# Vivado block design bd_48ac, xcvu9p-flga2104-2L-e, Vivado 2018.2
# (continued, part 3 of 4)
current_bd_instance /s09_entry_pipeline

create_bd_cell -type ip -vlnv xilinx.com:ip:sc_mmu:1.0 s09_mmu
set_property -dict [list \
  CONFIG.IS_CASCADED 0 \
  CONFIG.NUM_SEG 3 \
  CONFIG.MSC_ROUTE_WIDTH 1 \
  CONFIG.NUM_MSC 1 \
  CONFIG.ADDR_WIDTH 32 \
  CONFIG.RDATA_WIDTH 32 \
  CONFIG.WDATA_WIDTH 32 \
  CONFIG.S_PROTOCOL AXI4LITE \
  CONFIG.READ_WRITE_MODE READ_WRITE \
  CONFIG.SEG000_BASE_ADDR 0x0000000000000000 \
  CONFIG.SEG000_SIZE 29 \
  CONFIG.SEG000_SEP_ROUTE 0b0000000000000000000000000000000000000000000000000000000000000100 \
  CONFIG.SEG000_SUPPORTS_READ 1 \
  CONFIG.SEG000_SUPPORTS_WRITE 1 \
  CONFIG.SEG000_SECURE_READ 0 \
  CONFIG.SEG000_SECURE_WRITE 0 \
  CONFIG.SEG001_BASE_ADDR 0x0000000044A00000 \
  CONFIG.SEG001_SIZE 16 \
  CONFIG.SEG001_SEP_ROUTE 0b0000000000000000000000000000000000000000000000000000000000000010 \
  CONFIG.SEG001_SUPPORTS_READ 1 \
  CONFIG.SEG001_SUPPORTS_WRITE 1 \
  CONFIG.SEG001_SECURE_READ 0 \
  CONFIG.SEG001_SECURE_WRITE 0 \
  CONFIG.SEG002_BASE_ADDR 0x0000000080000000 \
  CONFIG.SEG002_SIZE 31 \
  CONFIG.SEG002_SEP_ROUTE 0b0000000000000000000000000000000000000000000000000000000000000000 \
  CONFIG.SEG002_SUPPORTS_READ 1 \
  CONFIG.SEG002_SUPPORTS_WRITE 1 \
  CONFIG.SEG002_SECURE_READ 0 \
  CONFIG.SEG002_SECURE_WRITE 0 \
  CONFIG.MSC000_ROUTE 0b1 \
] [get_bd_cells s09_mmu]
create_bd_cell -type ip -vlnv xilinx.com:ip:sc_transaction_regulator:1.0 s09_transaction_regulator
set_property -dict [list \
  CONFIG.READ_WRITE_MODE READ_WRITE \
  CONFIG.IS_CASCADED 0 \
  CONFIG.MEP_IDENTIFIER 19 \
  CONFIG.MEP_IDENTIFIER_WIDTH 6 \
  CONFIG.ADDR_WIDTH 32 \
  CONFIG.S_ID_WIDTH 0 \
  CONFIG.WDATA_WIDTH 32 \
  CONFIG.RDATA_WIDTH 32 \
  CONFIG.SEP_ROUTE_WIDTH 3 \
  CONFIG.SUPPORTS_READ_DEADLOCK 1 \
  CONFIG.SUPPORTS_WRITE_DEADLOCK 1 \
] [get_bd_cells s09_transaction_regulator]
create_bd_cell -type ip -vlnv xilinx.com:ip:sc_si_converter:1.0 s09_si_converter
set_property -dict [list \
  CONFIG.READ_WRITE_MODE READ_WRITE \
  CONFIG.LIMIT_READ_LENGTH 0 \
  CONFIG.LIMIT_WRITE_LENGTH 0 \
  CONFIG.IS_CASCADED 0 \
  CONFIG.NUM_READ_THREADS 1 \
  CONFIG.NUM_WRITE_THREADS 1 \
  CONFIG.MEP_IDENTIFIER_WIDTH 6 \
  CONFIG.SUPPORTS_NARROW 0 \
  CONFIG.HAS_BURST 0 \
  CONFIG.NUM_SEG 3 \
  CONFIG.ADDR_WIDTH 32 \
  CONFIG.ID_WIDTH 6 \
  CONFIG.RDATA_WIDTH 32 \
  CONFIG.WDATA_WIDTH 32 \
  CONFIG.NUM_MSC 1 \
  CONFIG.S_RUSER_BITS_PER_BYTE 0 \
  CONFIG.S_WUSER_BITS_PER_BYTE 0 \
  CONFIG.MAX_RUSER_BITS_PER_BYTE 0 \
  CONFIG.MAX_WUSER_BITS_PER_BYTE 0 \
  CONFIG.SEP000_RDATA_WIDTH 32 \
  CONFIG.SEP000_WDATA_WIDTH 32 \
  CONFIG.SEP000_PROTOCOL AXI4LITE \
  CONFIG.SEP001_RDATA_WIDTH 32 \
  CONFIG.SEP001_WDATA_WIDTH 32 \
  CONFIG.SEP001_PROTOCOL AXI4LITE \
  CONFIG.SEP002_RDATA_WIDTH 512 \
  CONFIG.SEP002_WDATA_WIDTH 512 \
  CONFIG.SEP002_PROTOCOL AXI4 \
  CONFIG.MSC000_RDATA_WIDTH 512 \
  CONFIG.MSC000_WDATA_WIDTH 512 \
] [get_bd_cells s09_si_converter]

# ---- hierarchy /s09_nodes ----
current_bd_instance /s09_nodes
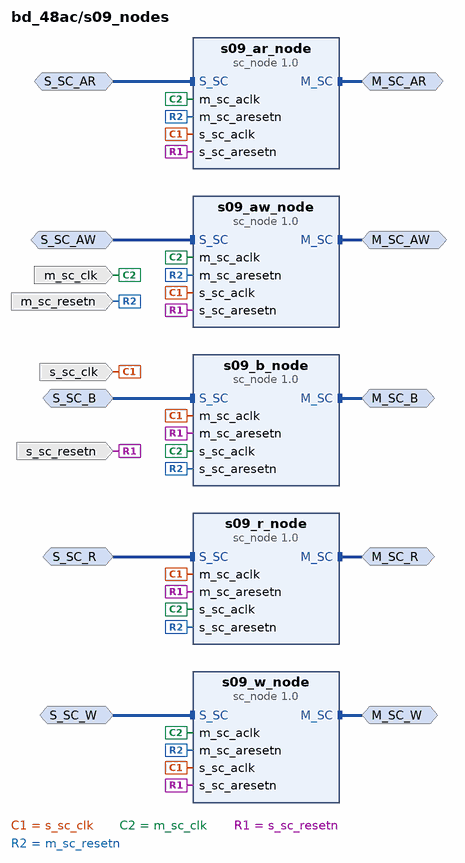
[diagram p22: block diagram inside /s09_nodes]
create_bd_intf_pin -mode Master -vlnv xilinx.com:interface:sc_rtl:1.0 M_SC_AR
create_bd_intf_pin -mode Slave -vlnv xilinx.com:interface:sc_rtl:1.0 S_SC_AR
create_bd_intf_pin -mode Master -vlnv xilinx.com:interface:sc_rtl:1.0 M_SC_R
create_bd_intf_pin -mode Slave -vlnv xilinx.com:interface:sc_rtl:1.0 S_SC_R
create_bd_intf_pin -mode Master -vlnv xilinx.com:interface:sc_rtl:1.0 M_SC_AW
create_bd_intf_pin -mode Slave -vlnv xilinx.com:interface:sc_rtl:1.0 S_SC_AW
create_bd_intf_pin -mode Master -vlnv xilinx.com:interface:sc_rtl:1.0 M_SC_W
create_bd_intf_pin -mode Slave -vlnv xilinx.com:interface:sc_rtl:1.0 S_SC_W
create_bd_intf_pin -mode Master -vlnv xilinx.com:interface:sc_rtl:1.0 M_SC_B
create_bd_intf_pin -mode Slave -vlnv xilinx.com:interface:sc_rtl:1.0 S_SC_B
create_bd_pin -dir I -type clk s_sc_clk
create_bd_pin -dir I -type rst s_sc_resetn
create_bd_pin -dir I -type clk m_sc_clk
create_bd_pin -dir I -type rst m_sc_resetn

create_bd_cell -type ip -vlnv xilinx.com:ip:sc_node:1.0 s09_ar_node
set_property -dict [list \
  CONFIG.NUM_SI 1 \
  CONFIG.NUM_MI 1 \
  CONFIG.CHANNEL 2 \
  CONFIG.MAX_PAYLD_BYTES 64 \
  CONFIG.SC_ROUTE_WIDTH 1 \
  CONFIG.ID_WIDTH 6 \
  CONFIG.PAYLD_WIDTH 148 \
  CONFIG.ADDR_WIDTH 32 \
  CONFIG.USER_WIDTH 0 \
  CONFIG.M_PIPELINE 0 \
  CONFIG.ACLK_RELATIONSHIP 0 \
  CONFIG.ACLKEN_CONVERSION 0 \
  CONFIG.S00_NUM_BYTES 4 \
  CONFIG.S01_NUM_BYTES 4 \
  CONFIG.S02_NUM_BYTES 4 \
  CONFIG.S03_NUM_BYTES 4 \
  CONFIG.S04_NUM_BYTES 4 \
  CONFIG.S05_NUM_BYTES 4 \
  CONFIG.S06_NUM_BYTES 4 \
  CONFIG.S07_NUM_BYTES 4 \
  CONFIG.S08_NUM_BYTES 4 \
  CONFIG.S09_NUM_BYTES 4 \
  CONFIG.S10_NUM_BYTES 4 \
  CONFIG.S11_NUM_BYTES 4 \
  CONFIG.S12_NUM_BYTES 4 \
  CONFIG.S13_NUM_BYTES 4 \
  CONFIG.S14_NUM_BYTES 4 \
  CONFIG.S15_NUM_BYTES 4 \
  CONFIG.M00_NUM_BYTES 64 \
  CONFIG.M01_NUM_BYTES 64 \
  CONFIG.M02_NUM_BYTES 64 \
  CONFIG.M03_NUM_BYTES 64 \
  CONFIG.M04_NUM_BYTES 64 \
  CONFIG.M05_NUM_BYTES 64 \
  CONFIG.M06_NUM_BYTES 64 \
  CONFIG.M07_NUM_BYTES 64 \
  CONFIG.M08_NUM_BYTES 64 \
  CONFIG.M09_NUM_BYTES 64 \
  CONFIG.M10_NUM_BYTES 64 \
  CONFIG.M11_NUM_BYTES 64 \
  CONFIG.M12_NUM_BYTES 64 \
  CONFIG.M13_NUM_BYTES 64 \
  CONFIG.M14_NUM_BYTES 64 \
  CONFIG.M15_NUM_BYTES 64 \
] [get_bd_cells s09_ar_node]
create_bd_cell -type ip -vlnv xilinx.com:ip:sc_node:1.0 s09_r_node
set_property -dict [list \
  CONFIG.NUM_SI 1 \
  CONFIG.NUM_MI 1 \
  CONFIG.CHANNEL 0 \
  CONFIG.USER_BITS_PER_BYTE 0 \
  CONFIG.MAX_PAYLD_BYTES 64 \
  CONFIG.SC_ROUTE_WIDTH 10 \
  CONFIG.ID_WIDTH 6 \
  CONFIG.PAYLD_WIDTH 545 \
  CONFIG.ADDR_WIDTH 32 \
  CONFIG.M_SEND_PIPELINE 0 \
  CONFIG.S_LATENCY 1 \
  CONFIG.ACLK_RELATIONSHIP 0 \
  CONFIG.ACLKEN_CONVERSION 0 \
  CONFIG.S00_NUM_BYTES 64 \
  CONFIG.S01_NUM_BYTES 64 \
  CONFIG.S02_NUM_BYTES 64 \
  CONFIG.S03_NUM_BYTES 64 \
  CONFIG.S04_NUM_BYTES 64 \
  CONFIG.S05_NUM_BYTES 64 \
  CONFIG.S06_NUM_BYTES 64 \
  CONFIG.S07_NUM_BYTES 64 \
  CONFIG.S08_NUM_BYTES 64 \
  CONFIG.S09_NUM_BYTES 64 \
  CONFIG.S10_NUM_BYTES 64 \
  CONFIG.S11_NUM_BYTES 64 \
  CONFIG.S12_NUM_BYTES 64 \
  CONFIG.S13_NUM_BYTES 64 \
  CONFIG.S14_NUM_BYTES 64 \
  CONFIG.S15_NUM_BYTES 64 \
  CONFIG.M00_NUM_BYTES 4 \
  CONFIG.M01_NUM_BYTES 4 \
  CONFIG.M02_NUM_BYTES 4 \
  CONFIG.M03_NUM_BYTES 4 \
  CONFIG.M04_NUM_BYTES 4 \
  CONFIG.M05_NUM_BYTES 4 \
  CONFIG.M06_NUM_BYTES 4 \
  CONFIG.M07_NUM_BYTES 4 \
  CONFIG.M08_NUM_BYTES 4 \
  CONFIG.M09_NUM_BYTES 4 \
  CONFIG.M10_NUM_BYTES 4 \
  CONFIG.M11_NUM_BYTES 4 \
  CONFIG.M12_NUM_BYTES 4 \
  CONFIG.M13_NUM_BYTES 4 \
  CONFIG.M14_NUM_BYTES 4 \
  CONFIG.M15_NUM_BYTES 4 \
] [get_bd_cells s09_r_node]
create_bd_cell -type ip -vlnv xilinx.com:ip:sc_node:1.0 s09_aw_node
set_property -dict [list \
  CONFIG.NUM_SI 1 \
  CONFIG.NUM_MI 1 \
  CONFIG.CHANNEL 3 \
  CONFIG.MAX_PAYLD_BYTES 64 \
  CONFIG.SC_ROUTE_WIDTH 1 \
  CONFIG.ID_WIDTH 6 \
  CONFIG.PAYLD_WIDTH 148 \
  CONFIG.ADDR_WIDTH 32 \
  CONFIG.USER_WIDTH 0 \
  CONFIG.M_PIPELINE 0 \
  CONFIG.ACLK_RELATIONSHIP 0 \
  CONFIG.ACLKEN_CONVERSION 0 \
  CONFIG.S00_NUM_BYTES 4 \
  CONFIG.S01_NUM_BYTES 4 \
  CONFIG.S02_NUM_BYTES 4 \
  CONFIG.S03_NUM_BYTES 4 \
  CONFIG.S04_NUM_BYTES 4 \
  CONFIG.S05_NUM_BYTES 4 \
  CONFIG.S06_NUM_BYTES 4 \
  CONFIG.S07_NUM_BYTES 4 \
  CONFIG.S08_NUM_BYTES 4 \
  CONFIG.S09_NUM_BYTES 4 \
  CONFIG.S10_NUM_BYTES 4 \
  CONFIG.S11_NUM_BYTES 4 \
  CONFIG.S12_NUM_BYTES 4 \
  CONFIG.S13_NUM_BYTES 4 \
  CONFIG.S14_NUM_BYTES 4 \
  CONFIG.S15_NUM_BYTES 4 \
  CONFIG.M00_NUM_BYTES 64 \
  CONFIG.M01_NUM_BYTES 64 \
  CONFIG.M02_NUM_BYTES 64 \
  CONFIG.M03_NUM_BYTES 64 \
  CONFIG.M04_NUM_BYTES 64 \
  CONFIG.M05_NUM_BYTES 64 \
  CONFIG.M06_NUM_BYTES 64 \
  CONFIG.M07_NUM_BYTES 64 \
  CONFIG.M08_NUM_BYTES 64 \
  CONFIG.M09_NUM_BYTES 64 \
  CONFIG.M10_NUM_BYTES 64 \
  CONFIG.M11_NUM_BYTES 64 \
  CONFIG.M12_NUM_BYTES 64 \
  CONFIG.M13_NUM_BYTES 64 \
  CONFIG.M14_NUM_BYTES 64 \
  CONFIG.M15_NUM_BYTES 64 \
] [get_bd_cells s09_aw_node]
create_bd_cell -type ip -vlnv xilinx.com:ip:sc_node:1.0 s09_w_node
set_property -dict [list \
  CONFIG.NUM_SI 1 \
  CONFIG.NUM_MI 1 \
  CONFIG.CHANNEL 1 \
  CONFIG.USER_BITS_PER_BYTE 0 \
  CONFIG.MAX_PAYLD_BYTES 64 \
  CONFIG.SC_ROUTE_WIDTH 1 \
  CONFIG.ID_WIDTH 6 \
  CONFIG.PAYLD_WIDTH 592 \
  CONFIG.ADDR_WIDTH 32 \
  CONFIG.M_PIPELINE 0 \
  CONFIG.ACLK_RELATIONSHIP 0 \
  CONFIG.ACLKEN_CONVERSION 0 \
  CONFIG.S00_NUM_BYTES 4 \
  CONFIG.S01_NUM_BYTES 4 \
  CONFIG.S02_NUM_BYTES 4 \
  CONFIG.S03_NUM_BYTES 4 \
  CONFIG.S04_NUM_BYTES 4 \
  CONFIG.S05_NUM_BYTES 4 \
  CONFIG.S06_NUM_BYTES 4 \
  CONFIG.S07_NUM_BYTES 4 \
  CONFIG.S08_NUM_BYTES 4 \
  CONFIG.S09_NUM_BYTES 4 \
  CONFIG.S10_NUM_BYTES 4 \
  CONFIG.S11_NUM_BYTES 4 \
  CONFIG.S12_NUM_BYTES 4 \
  CONFIG.S13_NUM_BYTES 4 \
  CONFIG.S14_NUM_BYTES 4 \
  CONFIG.S15_NUM_BYTES 4 \
  CONFIG.M00_NUM_BYTES 64 \
  CONFIG.M01_NUM_BYTES 64 \
  CONFIG.M02_NUM_BYTES 64 \
  CONFIG.M03_NUM_BYTES 64 \
  CONFIG.M04_NUM_BYTES 64 \
  CONFIG.M05_NUM_BYTES 64 \
  CONFIG.M06_NUM_BYTES 64 \
  CONFIG.M07_NUM_BYTES 64 \
  CONFIG.M08_NUM_BYTES 64 \
  CONFIG.M09_NUM_BYTES 64 \
  CONFIG.M10_NUM_BYTES 64 \
  CONFIG.M11_NUM_BYTES 64 \
  CONFIG.M12_NUM_BYTES 64 \
  CONFIG.M13_NUM_BYTES 64 \
  CONFIG.M14_NUM_BYTES 64 \
  CONFIG.M15_NUM_BYTES 64 \
] [get_bd_cells s09_w_node]
create_bd_cell -type ip -vlnv xilinx.com:ip:sc_node:1.0 s09_b_node
set_property -dict [list \
  CONFIG.NUM_SI 1 \
  CONFIG.NUM_MI 1 \
  CONFIG.CHANNEL 4 \
  CONFIG.MAX_PAYLD_BYTES 64 \
  CONFIG.SC_ROUTE_WIDTH 10 \
  CONFIG.ID_WIDTH 6 \
  CONFIG.PAYLD_WIDTH 19 \
  CONFIG.ADDR_WIDTH 32 \
  CONFIG.USER_WIDTH 0 \
  CONFIG.M_SEND_PIPELINE 0 \
  CONFIG.S_LATENCY 1 \
  CONFIG.ACLK_RELATIONSHIP 0 \
  CONFIG.ACLKEN_CONVERSION 0 \
  CONFIG.S00_NUM_BYTES 64 \
  CONFIG.S01_NUM_BYTES 64 \
  CONFIG.S02_NUM_BYTES 64 \
  CONFIG.S03_NUM_BYTES 64 \
  CONFIG.S04_NUM_BYTES 64 \
  CONFIG.S05_NUM_BYTES 64 \
  CONFIG.S06_NUM_BYTES 64 \
  CONFIG.S07_NUM_BYTES 64 \
  CONFIG.S08_NUM_BYTES 64 \
  CONFIG.S09_NUM_BYTES 64 \
  CONFIG.S10_NUM_BYTES 64 \
  CONFIG.S11_NUM_BYTES 64 \
  CONFIG.S12_NUM_BYTES 64 \
  CONFIG.S13_NUM_BYTES 64 \
  CONFIG.S14_NUM_BYTES 64 \
  CONFIG.S15_NUM_BYTES 64 \
  CONFIG.M00_NUM_BYTES 4 \
  CONFIG.M01_NUM_BYTES 4 \
  CONFIG.M02_NUM_BYTES 4 \
  CONFIG.M03_NUM_BYTES 4 \
  CONFIG.M04_NUM_BYTES 4 \
  CONFIG.M05_NUM_BYTES 4 \
  CONFIG.M06_NUM_BYTES 4 \
  CONFIG.M07_NUM_BYTES 4 \
  CONFIG.M08_NUM_BYTES 4 \
  CONFIG.M09_NUM_BYTES 4 \
  CONFIG.M10_NUM_BYTES 4 \
  CONFIG.M11_NUM_BYTES 4 \
  CONFIG.M12_NUM_BYTES 4 \
  CONFIG.M13_NUM_BYTES 4 \
  CONFIG.M14_NUM_BYTES 4 \
  CONFIG.M15_NUM_BYTES 4 \
] [get_bd_cells s09_b_node]

# ---- hierarchy /m00_nodes ----
current_bd_instance /m00_nodes
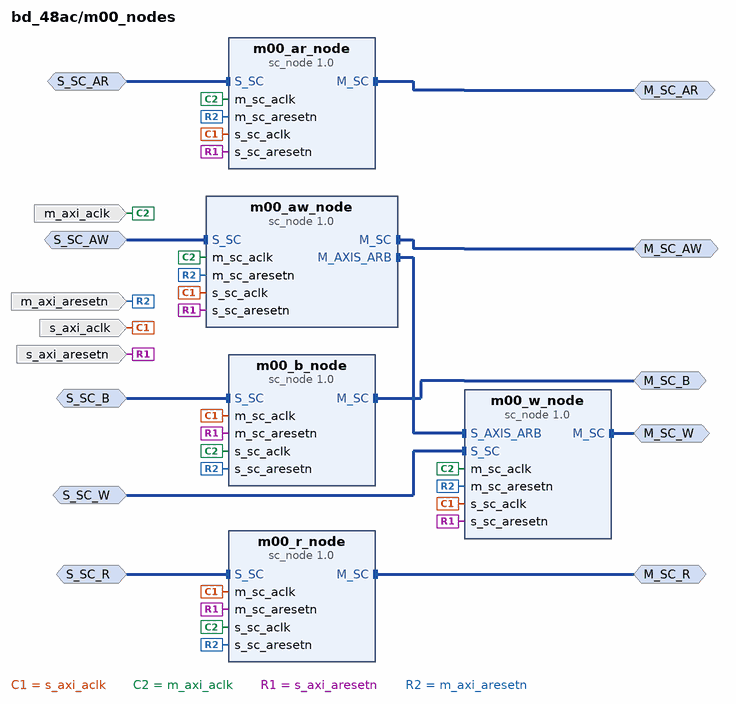
[diagram p23: block diagram inside /m00_nodes]
create_bd_intf_pin -mode Master -vlnv xilinx.com:interface:sc_rtl:1.0 M_SC_AR
create_bd_intf_pin -mode Slave -vlnv xilinx.com:interface:sc_rtl:1.0 S_SC_AR
create_bd_intf_pin -mode Master -vlnv xilinx.com:interface:sc_rtl:1.0 M_SC_R
create_bd_intf_pin -mode Slave -vlnv xilinx.com:interface:sc_rtl:1.0 S_SC_R
create_bd_intf_pin -mode Master -vlnv xilinx.com:interface:sc_rtl:1.0 M_SC_AW
create_bd_intf_pin -mode Slave -vlnv xilinx.com:interface:sc_rtl:1.0 S_SC_AW
create_bd_intf_pin -mode Master -vlnv xilinx.com:interface:sc_rtl:1.0 M_SC_W
create_bd_intf_pin -mode Slave -vlnv xilinx.com:interface:sc_rtl:1.0 S_SC_W
create_bd_intf_pin -mode Master -vlnv xilinx.com:interface:sc_rtl:1.0 M_SC_B
create_bd_intf_pin -mode Slave -vlnv xilinx.com:interface:sc_rtl:1.0 S_SC_B
create_bd_pin -dir I -type clk s_axi_aclk
create_bd_pin -dir I -type rst s_axi_aresetn
create_bd_pin -dir I -type clk m_axi_aclk
create_bd_pin -dir I -type rst m_axi_aresetn

create_bd_cell -type ip -vlnv xilinx.com:ip:sc_node:1.0 m00_ar_node
set_property -dict [list \
  CONFIG.NUM_SI 10 \
  CONFIG.NUM_MI 1 \
  CONFIG.CHANNEL 2 \
  CONFIG.MAX_PAYLD_BYTES 64 \
  CONFIG.SC_ROUTE_WIDTH 1 \
  CONFIG.ID_WIDTH 6 \
  CONFIG.PAYLD_WIDTH 148 \
  CONFIG.ADDR_WIDTH 32 \
  CONFIG.USER_WIDTH 0 \
  CONFIG.M_SEND_PIPELINE 0 \
  CONFIG.S_LATENCY 1 \
  CONFIG.ACLK_RELATIONSHIP 1 \
  CONFIG.S00_NUM_BYTES 64 \
  CONFIG.S01_NUM_BYTES 64 \
  CONFIG.S02_NUM_BYTES 64 \
  CONFIG.S03_NUM_BYTES 64 \
  CONFIG.S04_NUM_BYTES 64 \
  CONFIG.S05_NUM_BYTES 64 \
  CONFIG.S06_NUM_BYTES 64 \
  CONFIG.S07_NUM_BYTES 64 \
  CONFIG.S08_NUM_BYTES 64 \
  CONFIG.S09_NUM_BYTES 64 \
  CONFIG.S10_NUM_BYTES 64 \
  CONFIG.S11_NUM_BYTES 64 \
  CONFIG.S12_NUM_BYTES 64 \
  CONFIG.S13_NUM_BYTES 64 \
  CONFIG.S14_NUM_BYTES 64 \
  CONFIG.S15_NUM_BYTES 64 \
  CONFIG.M00_NUM_BYTES 64 \
  CONFIG.M01_NUM_BYTES 64 \
  CONFIG.M02_NUM_BYTES 64 \
  CONFIG.M03_NUM_BYTES 64 \
  CONFIG.M04_NUM_BYTES 64 \
  CONFIG.M05_NUM_BYTES 64 \
  CONFIG.M06_NUM_BYTES 64 \
  CONFIG.M07_NUM_BYTES 64 \
  CONFIG.M08_NUM_BYTES 64 \
  CONFIG.M09_NUM_BYTES 64 \
  CONFIG.M10_NUM_BYTES 64 \
  CONFIG.M11_NUM_BYTES 64 \
  CONFIG.M12_NUM_BYTES 64 \
  CONFIG.M13_NUM_BYTES 64 \
  CONFIG.M14_NUM_BYTES 64 \
  CONFIG.M15_NUM_BYTES 64 \
] [get_bd_cells m00_ar_node]
create_bd_cell -type ip -vlnv xilinx.com:ip:sc_node:1.0 m00_r_node
set_property -dict [list \
  CONFIG.NUM_SI 1 \
  CONFIG.NUM_MI 10 \
  CONFIG.CHANNEL 0 \
  CONFIG.USER_BITS_PER_BYTE 0 \
  CONFIG.MAX_PAYLD_BYTES 64 \
  CONFIG.SC_ROUTE_WIDTH 10 \
  CONFIG.ID_WIDTH 6 \
  CONFIG.PAYLD_WIDTH 545 \
  CONFIG.ADDR_WIDTH 32 \
  CONFIG.USER_WIDTH 0 \
  CONFIG.M_PIPELINE 0 \
  CONFIG.ACLK_RELATIONSHIP 1 \
  CONFIG.S00_NUM_BYTES 64 \
  CONFIG.S01_NUM_BYTES 64 \
  CONFIG.S02_NUM_BYTES 64 \
  CONFIG.S03_NUM_BYTES 64 \
  CONFIG.S04_NUM_BYTES 64 \
  CONFIG.S05_NUM_BYTES 64 \
  CONFIG.S06_NUM_BYTES 64 \
  CONFIG.S07_NUM_BYTES 64 \
  CONFIG.S08_NUM_BYTES 64 \
  CONFIG.S09_NUM_BYTES 64 \
  CONFIG.S10_NUM_BYTES 64 \
  CONFIG.S11_NUM_BYTES 64 \
  CONFIG.S12_NUM_BYTES 64 \
  CONFIG.S13_NUM_BYTES 64 \
  CONFIG.S14_NUM_BYTES 64 \
  CONFIG.S15_NUM_BYTES 64 \
  CONFIG.M00_NUM_BYTES 64 \
  CONFIG.M01_NUM_BYTES 64 \
  CONFIG.M02_NUM_BYTES 64 \
  CONFIG.M03_NUM_BYTES 64 \
  CONFIG.M04_NUM_BYTES 64 \
  CONFIG.M05_NUM_BYTES 64 \
  CONFIG.M06_NUM_BYTES 64 \
  CONFIG.M07_NUM_BYTES 64 \
  CONFIG.M08_NUM_BYTES 64 \
  CONFIG.M09_NUM_BYTES 64 \
  CONFIG.M10_NUM_BYTES 64 \
  CONFIG.M11_NUM_BYTES 64 \
  CONFIG.M12_NUM_BYTES 64 \
  CONFIG.M13_NUM_BYTES 64 \
  CONFIG.M14_NUM_BYTES 64 \
  CONFIG.M15_NUM_BYTES 64 \
] [get_bd_cells m00_r_node]
create_bd_cell -type ip -vlnv xilinx.com:ip:sc_node:1.0 m00_aw_node
set_property -dict [list \
  CONFIG.NUM_SI 10 \
  CONFIG.NUM_MI 1 \
  CONFIG.CHANNEL 3 \
  CONFIG.MAX_PAYLD_BYTES 64 \
  CONFIG.SC_ROUTE_WIDTH 1 \
  CONFIG.ID_WIDTH 6 \
  CONFIG.PAYLD_WIDTH 148 \
  CONFIG.ADDR_WIDTH 32 \
  CONFIG.USER_WIDTH 0 \
  CONFIG.M_SEND_PIPELINE 0 \
  CONFIG.S_LATENCY 1 \
  CONFIG.ACLK_RELATIONSHIP 1 \
  CONFIG.S00_NUM_BYTES 64 \
  CONFIG.S01_NUM_BYTES 64 \
  CONFIG.S02_NUM_BYTES 64 \
  CONFIG.S03_NUM_BYTES 64 \
  CONFIG.S04_NUM_BYTES 64 \
  CONFIG.S05_NUM_BYTES 64 \
  CONFIG.S06_NUM_BYTES 64 \
  CONFIG.S07_NUM_BYTES 64 \
  CONFIG.S08_NUM_BYTES 64 \
  CONFIG.S09_NUM_BYTES 64 \
  CONFIG.S10_NUM_BYTES 64 \
  CONFIG.S11_NUM_BYTES 64 \
  CONFIG.S12_NUM_BYTES 64 \
  CONFIG.S13_NUM_BYTES 64 \
  CONFIG.S14_NUM_BYTES 64 \
  CONFIG.S15_NUM_BYTES 64 \
  CONFIG.M00_NUM_BYTES 64 \
  CONFIG.M01_NUM_BYTES 64 \
  CONFIG.M02_NUM_BYTES 64 \
  CONFIG.M03_NUM_BYTES 64 \
  CONFIG.M04_NUM_BYTES 64 \
  CONFIG.M05_NUM_BYTES 64 \
  CONFIG.M06_NUM_BYTES 64 \
  CONFIG.M07_NUM_BYTES 64 \
  CONFIG.M08_NUM_BYTES 64 \
  CONFIG.M09_NUM_BYTES 64 \
  CONFIG.M10_NUM_BYTES 64 \
  CONFIG.M11_NUM_BYTES 64 \
  CONFIG.M12_NUM_BYTES 64 \
  CONFIG.M13_NUM_BYTES 64 \
  CONFIG.M14_NUM_BYTES 64 \
  CONFIG.M15_NUM_BYTES 64 \
] [get_bd_cells m00_aw_node]
create_bd_cell -type ip -vlnv xilinx.com:ip:sc_node:1.0 m00_w_node
set_property -dict [list \
  CONFIG.NUM_SI 10 \
  CONFIG.NUM_MI 1 \
  CONFIG.CHANNEL 1 \
  CONFIG.USER_BITS_PER_BYTE 0 \
  CONFIG.MAX_PAYLD_BYTES 64 \
  CONFIG.SC_ROUTE_WIDTH 1 \
  CONFIG.ID_WIDTH 6 \
  CONFIG.PAYLD_WIDTH 592 \
  CONFIG.ADDR_WIDTH 32 \
  CONFIG.USER_WIDTH 0 \
  CONFIG.M_SEND_PIPELINE 0 \
  CONFIG.S_LATENCY 1 \
  CONFIG.ACLK_RELATIONSHIP 1 \
  CONFIG.S00_NUM_BYTES 64 \
  CONFIG.S01_NUM_BYTES 64 \
  CONFIG.S02_NUM_BYTES 64 \
  CONFIG.S03_NUM_BYTES 64 \
  CONFIG.S04_NUM_BYTES 64 \
  CONFIG.S05_NUM_BYTES 64 \
  CONFIG.S06_NUM_BYTES 64 \
  CONFIG.S07_NUM_BYTES 64 \
  CONFIG.S08_NUM_BYTES 64 \
  CONFIG.S09_NUM_BYTES 64 \
  CONFIG.S10_NUM_BYTES 64 \
  CONFIG.S11_NUM_BYTES 64 \
  CONFIG.S12_NUM_BYTES 64 \
  CONFIG.S13_NUM_BYTES 64 \
  CONFIG.S14_NUM_BYTES 64 \
  CONFIG.S15_NUM_BYTES 64 \
  CONFIG.M00_NUM_BYTES 64 \
  CONFIG.M01_NUM_BYTES 64 \
  CONFIG.M02_NUM_BYTES 64 \
  CONFIG.M03_NUM_BYTES 64 \
  CONFIG.M04_NUM_BYTES 64 \
  CONFIG.M05_NUM_BYTES 64 \
  CONFIG.M06_NUM_BYTES 64 \
  CONFIG.M07_NUM_BYTES 64 \
  CONFIG.M08_NUM_BYTES 64 \
  CONFIG.M09_NUM_BYTES 64 \
  CONFIG.M10_NUM_BYTES 64 \
  CONFIG.M11_NUM_BYTES 64 \
  CONFIG.M12_NUM_BYTES 64 \
  CONFIG.M13_NUM_BYTES 64 \
  CONFIG.M14_NUM_BYTES 64 \
  CONFIG.M15_NUM_BYTES 64 \
] [get_bd_cells m00_w_node]
create_bd_cell -type ip -vlnv xilinx.com:ip:sc_node:1.0 m00_b_node
set_property -dict [list \
  CONFIG.NUM_SI 1 \
  CONFIG.NUM_MI 10 \
  CONFIG.CHANNEL 4 \
  CONFIG.MAX_PAYLD_BYTES 64 \
  CONFIG.SC_ROUTE_WIDTH 10 \
  CONFIG.ID_WIDTH 6 \
  CONFIG.PAYLD_WIDTH 19 \
  CONFIG.ADDR_WIDTH 32 \
  CONFIG.USER_WIDTH 0 \
  CONFIG.M_PIPELINE 0 \
  CONFIG.ACLK_RELATIONSHIP 1 \
  CONFIG.S00_NUM_BYTES 64 \
  CONFIG.S01_NUM_BYTES 64 \
  CONFIG.S02_NUM_BYTES 64 \
  CONFIG.S03_NUM_BYTES 64 \
  CONFIG.S04_NUM_BYTES 64 \
  CONFIG.S05_NUM_BYTES 64 \
  CONFIG.S06_NUM_BYTES 64 \
  CONFIG.S07_NUM_BYTES 64 \
  CONFIG.S08_NUM_BYTES 64 \
  CONFIG.S09_NUM_BYTES 64 \
  CONFIG.S10_NUM_BYTES 64 \
  CONFIG.S11_NUM_BYTES 64 \
  CONFIG.S12_NUM_BYTES 64 \
  CONFIG.S13_NUM_BYTES 64 \
  CONFIG.S14_NUM_BYTES 64 \
  CONFIG.S15_NUM_BYTES 64 \
  CONFIG.M00_NUM_BYTES 64 \
  CONFIG.M01_NUM_BYTES 64 \
  CONFIG.M02_NUM_BYTES 64 \
  CONFIG.M03_NUM_BYTES 64 \
  CONFIG.M04_NUM_BYTES 64 \
  CONFIG.M05_NUM_BYTES 64 \
  CONFIG.M06_NUM_BYTES 64 \
  CONFIG.M07_NUM_BYTES 64 \
  CONFIG.M08_NUM_BYTES 64 \
  CONFIG.M09_NUM_BYTES 64 \
  CONFIG.M10_NUM_BYTES 64 \
  CONFIG.M11_NUM_BYTES 64 \
  CONFIG.M12_NUM_BYTES 64 \
  CONFIG.M13_NUM_BYTES 64 \
  CONFIG.M14_NUM_BYTES 64 \
  CONFIG.M15_NUM_BYTES 64 \
] [get_bd_cells m00_b_node]

# ---- hierarchy /m00_exit_pipeline ----
current_bd_instance /m00_exit_pipeline
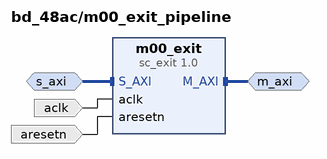
[diagram p24: block diagram inside /m00_exit_pipeline]
create_bd_intf_pin -mode Slave -vlnv xilinx.com:interface:aximm_rtl:1.0 s_axi
create_bd_intf_pin -mode Master -vlnv xilinx.com:interface:aximm_rtl:1.0 m_axi
create_bd_pin -dir I -type clk aclk
create_bd_pin -dir I -type rst aresetn

create_bd_cell -type ip -vlnv xilinx.com:ip:sc_exit:1.0 m00_exit
set_property -dict [list \
  CONFIG.READ_WRITE_MODE READ_WRITE \
  CONFIG.IS_CASCADED 1 \
  CONFIG.SSC_ROUTE_WIDTH 10 \
  CONFIG.MEP_IDENTIFIER_WIDTH 6 \
  CONFIG.RDATA_WIDTH 512 \
  CONFIG.WDATA_WIDTH 512 \
  CONFIG.M_RUSER_BITS_PER_BYTE 0 \
  CONFIG.M_WUSER_BITS_PER_BYTE 0 \
  CONFIG.MAX_RUSER_BITS_PER_BYTE 0 \
  CONFIG.MAX_WUSER_BITS_PER_BYTE 0 \
  CONFIG.M_ARUSER_WIDTH 114 \
  CONFIG.M_AWUSER_WIDTH 114 \
  CONFIG.M_RUSER_WIDTH 14 \
  CONFIG.M_WUSER_WIDTH 14 \
  CONFIG.M_BUSER_WIDTH 114 \
  CONFIG.S_ID_WIDTH 6 \
  CONFIG.M_MAX_BURST_LENGTH 1 \
  CONFIG.ADDR_WIDTH 32 \
  CONFIG.HAS_BURST 1 \
  CONFIG.NUM_MSC 1 \
  CONFIG.SSC000_ROUTE 0b0000000000 \
  CONFIG.SSC001_ROUTE 0b0000000000 \
  CONFIG.SSC002_ROUTE 0b0000000000 \
  CONFIG.SSC003_ROUTE 0b0000000000 \
  CONFIG.SSC004_ROUTE 0b0000000000 \
  CONFIG.SSC005_ROUTE 0b0000000000 \
  CONFIG.SSC006_ROUTE 0b0000000000 \
  CONFIG.SSC007_ROUTE 0b0000000000 \
  CONFIG.SSC008_ROUTE 0b0010000000 \
  CONFIG.SSC009_ROUTE 0b0100000000 \
  CONFIG.SSC010_ROUTE 0b0000000000 \
  CONFIG.SSC011_ROUTE 0b0000000000 \
  CONFIG.SSC012_ROUTE 0b0000000001 \
  CONFIG.SSC013_ROUTE 0b0000000010 \
  CONFIG.SSC014_ROUTE 0b0000000100 \
  CONFIG.SSC015_ROUTE 0b0000001000 \
  CONFIG.SSC016_ROUTE 0b0000010000 \
  CONFIG.SSC017_ROUTE 0b0000100000 \
  CONFIG.SSC018_ROUTE 0b0001000000 \
  CONFIG.SSC019_ROUTE 0b1000000000 \
  CONFIG.SSC020_ROUTE 0b0000000000 \
  CONFIG.SSC021_ROUTE 0b0000000000 \
  CONFIG.SSC022_ROUTE 0b0000000000 \
  CONFIG.SSC023_ROUTE 0b0000000000 \
  CONFIG.SSC024_ROUTE 0b0000000000 \
  CONFIG.SSC025_ROUTE 0b0000000000 \
  CONFIG.SSC026_ROUTE 0b0000000000 \
  CONFIG.SSC027_ROUTE 0b0000000000 \
  CONFIG.SSC028_ROUTE 0b0000000000 \
  CONFIG.SSC029_ROUTE 0b0000000000 \
  CONFIG.SSC030_ROUTE 0b0000000000 \
  CONFIG.SSC031_ROUTE 0b0000000000 \
  CONFIG.SSC032_ROUTE 0b0000000000 \
  CONFIG.SSC033_ROUTE 0b0000000000 \
  CONFIG.SSC034_ROUTE 0b0000000000 \
  CONFIG.SSC035_ROUTE 0b0000000000 \
  CONFIG.SSC036_ROUTE 0b0000000000 \
  CONFIG.SSC037_ROUTE 0b0000000000 \
  CONFIG.SSC038_ROUTE 0b0000000000 \
  CONFIG.SSC039_ROUTE 0b0000000000 \
  CONFIG.SSC040_ROUTE 0b0000000000 \
  CONFIG.SSC041_ROUTE 0b0000000000 \
  CONFIG.SSC042_ROUTE 0b0000000000 \
  CONFIG.SSC043_ROUTE 0b0000000000 \
  CONFIG.SSC044_ROUTE 0b0000000000 \
  CONFIG.SSC045_ROUTE 0b0000000000 \
  CONFIG.SSC046_ROUTE 0b0000000000 \
  CONFIG.SSC047_ROUTE 0b0000000000 \
  CONFIG.SSC048_ROUTE 0b0000000000 \
  CONFIG.SSC049_ROUTE 0b0000000000 \
  CONFIG.SSC050_ROUTE 0b0000000000 \
  CONFIG.SSC051_ROUTE 0b0000000000 \
  CONFIG.SSC052_ROUTE 0b0000000000 \
  CONFIG.SSC053_ROUTE 0b0000000000 \
  CONFIG.SSC054_ROUTE 0b0000000000 \
  CONFIG.SSC055_ROUTE 0b0000000000 \
  CONFIG.SSC056_ROUTE 0b0000000000 \
  CONFIG.SSC057_ROUTE 0b0000000000 \
  CONFIG.SSC058_ROUTE 0b0000000000 \
  CONFIG.SSC059_ROUTE 0b0000000000 \
  CONFIG.SSC060_ROUTE 0b0000000000 \
  CONFIG.SSC061_ROUTE 0b0000000000 \
  CONFIG.SSC062_ROUTE 0b0000000000 \
  CONFIG.SSC063_ROUTE 0b0000000000 \
] [get_bd_cells m00_exit]

# ---- connections ----

current_bd_instance /clk_map
connect_bd_net -net clk_map_aresetn_net [get_bd_pins aresetn] \
  [get_bd_pins psr0/aux_reset_in] [get_bd_pins psr_aclk/aux_reset_in] [get_bd_pins psr_aclk3/aux_reset_in]
connect_bd_net -net clk_map_aclk3_net [get_bd_pins aclk3] \
  [get_bd_pins S00_ACLK] [get_bd_pins S01_ACLK] [get_bd_pins S02_ACLK] [get_bd_pins S03_ACLK] [get_bd_pins S04_ACLK] \
  [get_bd_pins S05_ACLK] [get_bd_pins S06_ACLK] [get_bd_pins S07_ACLK] [get_bd_pins S08_ACLK] [get_bd_pins S09_ACLK] \
  [get_bd_pins psr0/slowest_sync_clk] [get_bd_pins psr_aclk3/slowest_sync_clk]
connect_bd_net -net clk_map_aclk_net [get_bd_pins aclk] [get_bd_pins M00_ACLK] [get_bd_pins swbd_aclk] [get_bd_pins psr_aclk/slowest_sync_clk]
connect_bd_net [get_bd_pins one/dout] [get_bd_pins psr0/ext_reset_in]
connect_bd_net [get_bd_pins psr_aclk/interconnect_aresetn] [get_bd_pins M00_ARESETN] [get_bd_pins swbd_aresetn]
connect_bd_net [get_bd_pins psr_aclk3/interconnect_aresetn] \
  [get_bd_pins S00_ARESETN] [get_bd_pins S01_ARESETN] [get_bd_pins S02_ARESETN] [get_bd_pins S03_ARESETN] \
  [get_bd_pins S04_ARESETN] [get_bd_pins S05_ARESETN] [get_bd_pins S06_ARESETN] [get_bd_pins S07_ARESETN] \
  [get_bd_pins S08_ARESETN] [get_bd_pins S09_ARESETN]
connect_bd_net [get_bd_pins psr0/interconnect_aresetn] [get_bd_pins psr_aclk/ext_reset_in] [get_bd_pins psr_aclk3/ext_reset_in]

current_bd_instance /switchboards
connect_bd_intf_net [get_bd_intf_pins S00_SC_AR] [get_bd_intf_pins ar_switchboard/S00_SC]
connect_bd_intf_net [get_bd_intf_pins S01_SC_AR] [get_bd_intf_pins ar_switchboard/S01_SC]
connect_bd_intf_net [get_bd_intf_pins S02_SC_AR] [get_bd_intf_pins ar_switchboard/S02_SC]
connect_bd_intf_net [get_bd_intf_pins S03_SC_AR] [get_bd_intf_pins ar_switchboard/S03_SC]
connect_bd_intf_net [get_bd_intf_pins S04_SC_AR] [get_bd_intf_pins ar_switchboard/S04_SC]
connect_bd_intf_net [get_bd_intf_pins S05_SC_AR] [get_bd_intf_pins ar_switchboard/S05_SC]
connect_bd_intf_net [get_bd_intf_pins S06_SC_AR] [get_bd_intf_pins ar_switchboard/S06_SC]
connect_bd_intf_net [get_bd_intf_pins S07_SC_AR] [get_bd_intf_pins ar_switchboard/S07_SC]
connect_bd_intf_net [get_bd_intf_pins S08_SC_AR] [get_bd_intf_pins ar_switchboard/S08_SC]
connect_bd_intf_net [get_bd_intf_pins S09_SC_AR] [get_bd_intf_pins ar_switchboard/S09_SC]
connect_bd_intf_net [get_bd_intf_pins M00_SC_AR] [get_bd_intf_pins ar_switchboard/M00_SC]
connect_bd_intf_net [get_bd_intf_pins S00_SC_R] [get_bd_intf_pins r_switchboard/S00_SC]
connect_bd_intf_net [get_bd_intf_pins M00_SC_R] [get_bd_intf_pins r_switchboard/M00_SC]
connect_bd_intf_net [get_bd_intf_pins M01_SC_R] [get_bd_intf_pins r_switchboard/M01_SC]
connect_bd_intf_net [get_bd_intf_pins M02_SC_R] [get_bd_intf_pins r_switchboard/M02_SC]
connect_bd_intf_net [get_bd_intf_pins M03_SC_R] [get_bd_intf_pins r_switchboard/M03_SC]
connect_bd_intf_net [get_bd_intf_pins M04_SC_R] [get_bd_intf_pins r_switchboard/M04_SC]
connect_bd_intf_net [get_bd_intf_pins M05_SC_R] [get_bd_intf_pins r_switchboard/M05_SC]
connect_bd_intf_net [get_bd_intf_pins M06_SC_R] [get_bd_intf_pins r_switchboard/M06_SC]
connect_bd_intf_net [get_bd_intf_pins M07_SC_R] [get_bd_intf_pins r_switchboard/M07_SC]
connect_bd_intf_net [get_bd_intf_pins M08_SC_R] [get_bd_intf_pins r_switchboard/M08_SC]
connect_bd_intf_net [get_bd_intf_pins M09_SC_R] [get_bd_intf_pins r_switchboard/M09_SC]
connect_bd_intf_net [get_bd_intf_pins S00_SC_AW] [get_bd_intf_pins aw_switchboard/S00_SC]
connect_bd_intf_net [get_bd_intf_pins S01_SC_AW] [get_bd_intf_pins aw_switchboard/S01_SC]
connect_bd_intf_net [get_bd_intf_pins S02_SC_AW] [get_bd_intf_pins aw_switchboard/S02_SC]
connect_bd_intf_net [get_bd_intf_pins S03_SC_AW] [get_bd_intf_pins aw_switchboard/S03_SC]
connect_bd_intf_net [get_bd_intf_pins S04_SC_AW] [get_bd_intf_pins aw_switchboard/S04_SC]
connect_bd_intf_net [get_bd_intf_pins S05_SC_AW] [get_bd_intf_pins aw_switchboard/S05_SC]
connect_bd_intf_net [get_bd_intf_pins S06_SC_AW] [get_bd_intf_pins aw_switchboard/S06_SC]
connect_bd_intf_net [get_bd_intf_pins S07_SC_AW] [get_bd_intf_pins aw_switchboard/S07_SC]
connect_bd_intf_net [get_bd_intf_pins S08_SC_AW] [get_bd_intf_pins aw_switchboard/S08_SC]
connect_bd_intf_net [get_bd_intf_pins S09_SC_AW] [get_bd_intf_pins aw_switchboard/S09_SC]
connect_bd_intf_net [get_bd_intf_pins M00_SC_AW] [get_bd_intf_pins aw_switchboard/M00_SC]
connect_bd_intf_net [get_bd_intf_pins S00_SC_W] [get_bd_intf_pins w_switchboard/S00_SC]
connect_bd_intf_net [get_bd_intf_pins S01_SC_W] [get_bd_intf_pins w_switchboard/S01_SC]
connect_bd_intf_net [get_bd_intf_pins S02_SC_W] [get_bd_intf_pins w_switchboard/S02_SC]
connect_bd_intf_net [get_bd_intf_pins S03_SC_W] [get_bd_intf_pins w_switchboard/S03_SC]
connect_bd_intf_net [get_bd_intf_pins S04_SC_W] [get_bd_intf_pins w_switchboard/S04_SC]
connect_bd_intf_net [get_bd_intf_pins S05_SC_W] [get_bd_intf_pins w_switchboard/S05_SC]
connect_bd_intf_net [get_bd_intf_pins S06_SC_W] [get_bd_intf_pins w_switchboard/S06_SC]
connect_bd_intf_net [get_bd_intf_pins S07_SC_W] [get_bd_intf_pins w_switchboard/S07_SC]
connect_bd_intf_net [get_bd_intf_pins S08_SC_W] [get_bd_intf_pins w_switchboard/S08_SC]
connect_bd_intf_net [get_bd_intf_pins S09_SC_W] [get_bd_intf_pins w_switchboard/S09_SC]
connect_bd_intf_net [get_bd_intf_pins M00_SC_W] [get_bd_intf_pins w_switchboard/M00_SC]
connect_bd_intf_net [get_bd_intf_pins S00_SC_B] [get_bd_intf_pins b_switchboard/S00_SC]
connect_bd_intf_net [get_bd_intf_pins M00_SC_B] [get_bd_intf_pins b_switchboard/M00_SC]
connect_bd_intf_net [get_bd_intf_pins M01_SC_B] [get_bd_intf_pins b_switchboard/M01_SC]
connect_bd_intf_net [get_bd_intf_pins M02_SC_B] [get_bd_intf_pins b_switchboard/M02_SC]
connect_bd_intf_net [get_bd_intf_pins M03_SC_B] [get_bd_intf_pins b_switchboard/M03_SC]
connect_bd_intf_net [get_bd_intf_pins M04_SC_B] [get_bd_intf_pins b_switchboard/M04_SC]
connect_bd_intf_net [get_bd_intf_pins M05_SC_B] [get_bd_intf_pins b_switchboard/M05_SC]
connect_bd_intf_net [get_bd_intf_pins M06_SC_B] [get_bd_intf_pins b_switchboard/M06_SC]
connect_bd_intf_net [get_bd_intf_pins M07_SC_B] [get_bd_intf_pins b_switchboard/M07_SC]
connect_bd_intf_net [get_bd_intf_pins M08_SC_B] [get_bd_intf_pins b_switchboard/M08_SC]
connect_bd_intf_net [get_bd_intf_pins M09_SC_B] [get_bd_intf_pins b_switchboard/M09_SC]
connect_bd_net [get_bd_pins aclk] \
  [get_bd_pins ar_switchboard/aclk] [get_bd_pins aw_switchboard/aclk] [get_bd_pins b_switchboard/aclk] \
  [get_bd_pins r_switchboard/aclk] [get_bd_pins w_switchboard/aclk]

current_bd_instance /s00_entry_pipeline
connect_bd_intf_net [get_bd_intf_pins s00_mmu/M_AXI] [get_bd_intf_pins s00_transaction_regulator/S_AXI]
connect_bd_intf_net [get_bd_intf_pins s00_transaction_regulator/M_AXI] [get_bd_intf_pins s00_si_converter/S_AXI]
connect_bd_intf_net [get_bd_intf_pins s_axi] [get_bd_intf_pins s00_mmu/S_AXI]
connect_bd_intf_net [get_bd_intf_pins m_axi] [get_bd_intf_pins s00_si_converter/M_AXI]
connect_bd_net [get_bd_pins aclk] [get_bd_pins s00_mmu/aclk] [get_bd_pins s00_si_converter/aclk] [get_bd_pins s00_transaction_regulator/aclk]
connect_bd_net [get_bd_pins aresetn] \
  [get_bd_pins s00_mmu/aresetn] [get_bd_pins s00_si_converter/aresetn] [get_bd_pins s00_transaction_regulator/aresetn]

current_bd_instance /s00_nodes
connect_bd_intf_net [get_bd_intf_pins M_SC_AR] [get_bd_intf_pins s00_ar_node/M_SC]
connect_bd_intf_net [get_bd_intf_pins S_SC_AR] [get_bd_intf_pins s00_ar_node/S_SC]
connect_bd_intf_net [get_bd_intf_pins M_SC_R] [get_bd_intf_pins s00_r_node/M_SC]
connect_bd_intf_net [get_bd_intf_pins S_SC_R] [get_bd_intf_pins s00_r_node/S_SC]
connect_bd_net [get_bd_pins s_sc_clk] [get_bd_pins s00_ar_node/s_sc_aclk] [get_bd_pins s00_r_node/m_sc_aclk]
connect_bd_net [get_bd_pins m_sc_clk] [get_bd_pins s00_ar_node/m_sc_aclk] [get_bd_pins s00_r_node/s_sc_aclk]
connect_bd_net [get_bd_pins s_sc_resetn] [get_bd_pins s00_ar_node/s_sc_aresetn] [get_bd_pins s00_r_node/m_sc_aresetn]
connect_bd_net [get_bd_pins m_sc_resetn] [get_bd_pins s00_ar_node/m_sc_aresetn] [get_bd_pins s00_r_node/s_sc_aresetn]

current_bd_instance /s01_entry_pipeline
connect_bd_intf_net [get_bd_intf_pins s01_mmu/M_AXI] [get_bd_intf_pins s01_transaction_regulator/S_AXI]
connect_bd_intf_net [get_bd_intf_pins s01_transaction_regulator/M_AXI] [get_bd_intf_pins s01_si_converter/S_AXI]
connect_bd_intf_net [get_bd_intf_pins s_axi] [get_bd_intf_pins s01_mmu/S_AXI]
connect_bd_intf_net [get_bd_intf_pins m_axi] [get_bd_intf_pins s01_si_converter/M_AXI]
connect_bd_net [get_bd_pins aclk] [get_bd_pins s01_mmu/aclk] [get_bd_pins s01_si_converter/aclk] [get_bd_pins s01_transaction_regulator/aclk]
connect_bd_net [get_bd_pins aresetn] \
  [get_bd_pins s01_mmu/aresetn] [get_bd_pins s01_si_converter/aresetn] [get_bd_pins s01_transaction_regulator/aresetn]

current_bd_instance /s01_nodes
connect_bd_intf_net [get_bd_intf_pins M_SC_AW] [get_bd_intf_pins s01_aw_node/M_SC]
connect_bd_intf_net [get_bd_intf_pins S_SC_AW] [get_bd_intf_pins s01_aw_node/S_SC]
connect_bd_intf_net [get_bd_intf_pins M_SC_W] [get_bd_intf_pins s01_w_node/M_SC]
connect_bd_intf_net [get_bd_intf_pins S_SC_W] [get_bd_intf_pins s01_w_node/S_SC]
connect_bd_intf_net [get_bd_intf_pins M_SC_B] [get_bd_intf_pins s01_b_node/M_SC]
connect_bd_intf_net [get_bd_intf_pins S_SC_B] [get_bd_intf_pins s01_b_node/S_SC]
connect_bd_net [get_bd_pins s_sc_clk] [get_bd_pins s01_aw_node/s_sc_aclk] [get_bd_pins s01_w_node/s_sc_aclk] [get_bd_pins s01_b_node/m_sc_aclk]
connect_bd_net [get_bd_pins m_sc_clk] [get_bd_pins s01_aw_node/m_sc_aclk] [get_bd_pins s01_w_node/m_sc_aclk] [get_bd_pins s01_b_node/s_sc_aclk]
connect_bd_net [get_bd_pins s_sc_resetn] \
  [get_bd_pins s01_aw_node/s_sc_aresetn] [get_bd_pins s01_w_node/s_sc_aresetn] [get_bd_pins s01_b_node/m_sc_aresetn]
connect_bd_net [get_bd_pins m_sc_resetn] \
  [get_bd_pins s01_aw_node/m_sc_aresetn] [get_bd_pins s01_w_node/m_sc_aresetn] [get_bd_pins s01_b_node/s_sc_aresetn]

current_bd_instance /s02_entry_pipeline
connect_bd_intf_net [get_bd_intf_pins s02_mmu/M_AXI] [get_bd_intf_pins s02_transaction_regulator/S_AXI]
connect_bd_intf_net [get_bd_intf_pins s02_transaction_regulator/M_AXI] [get_bd_intf_pins s02_si_converter/S_AXI]
connect_bd_intf_net [get_bd_intf_pins s_axi] [get_bd_intf_pins s02_mmu/S_AXI]
connect_bd_intf_net [get_bd_intf_pins m_axi] [get_bd_intf_pins s02_si_converter/M_AXI]
connect_bd_net [get_bd_pins aclk] [get_bd_pins s02_mmu/aclk] [get_bd_pins s02_si_converter/aclk] [get_bd_pins s02_transaction_regulator/aclk]
connect_bd_net [get_bd_pins aresetn] \
  [get_bd_pins s02_mmu/aresetn] [get_bd_pins s02_si_converter/aresetn] [get_bd_pins s02_transaction_regulator/aresetn]

current_bd_instance /s02_nodes
connect_bd_intf_net [get_bd_intf_pins M_SC_AR] [get_bd_intf_pins s02_ar_node/M_SC]
connect_bd_intf_net [get_bd_intf_pins S_SC_AR] [get_bd_intf_pins s02_ar_node/S_SC]
connect_bd_intf_net [get_bd_intf_pins M_SC_R] [get_bd_intf_pins s02_r_node/M_SC]
connect_bd_intf_net [get_bd_intf_pins S_SC_R] [get_bd_intf_pins s02_r_node/S_SC]
connect_bd_net [get_bd_pins s_sc_clk] [get_bd_pins s02_ar_node/s_sc_aclk] [get_bd_pins s02_r_node/m_sc_aclk]
connect_bd_net [get_bd_pins m_sc_clk] [get_bd_pins s02_ar_node/m_sc_aclk] [get_bd_pins s02_r_node/s_sc_aclk]
connect_bd_net [get_bd_pins s_sc_resetn] [get_bd_pins s02_ar_node/s_sc_aresetn] [get_bd_pins s02_r_node/m_sc_aresetn]
connect_bd_net [get_bd_pins m_sc_resetn] [get_bd_pins s02_ar_node/m_sc_aresetn] [get_bd_pins s02_r_node/s_sc_aresetn]

current_bd_instance /s03_entry_pipeline
connect_bd_intf_net [get_bd_intf_pins s03_mmu/M_AXI] [get_bd_intf_pins s03_transaction_regulator/S_AXI]
connect_bd_intf_net [get_bd_intf_pins s03_transaction_regulator/M_AXI] [get_bd_intf_pins s03_si_converter/S_AXI]
connect_bd_intf_net [get_bd_intf_pins s_axi] [get_bd_intf_pins s03_mmu/S_AXI]
connect_bd_intf_net [get_bd_intf_pins m_axi] [get_bd_intf_pins s03_si_converter/M_AXI]
connect_bd_net [get_bd_pins aclk] [get_bd_pins s03_mmu/aclk] [get_bd_pins s03_si_converter/aclk] [get_bd_pins s03_transaction_regulator/aclk]
connect_bd_net [get_bd_pins aresetn] \
  [get_bd_pins s03_mmu/aresetn] [get_bd_pins s03_si_converter/aresetn] [get_bd_pins s03_transaction_regulator/aresetn]

current_bd_instance /s03_nodes
connect_bd_intf_net [get_bd_intf_pins M_SC_AW] [get_bd_intf_pins s03_aw_node/M_SC]
connect_bd_intf_net [get_bd_intf_pins S_SC_AW] [get_bd_intf_pins s03_aw_node/S_SC]
connect_bd_intf_net [get_bd_intf_pins M_SC_W] [get_bd_intf_pins s03_w_node/M_SC]
connect_bd_intf_net [get_bd_intf_pins S_SC_W] [get_bd_intf_pins s03_w_node/S_SC]
connect_bd_intf_net [get_bd_intf_pins M_SC_B] [get_bd_intf_pins s03_b_node/M_SC]
connect_bd_intf_net [get_bd_intf_pins S_SC_B] [get_bd_intf_pins s03_b_node/S_SC]
connect_bd_net [get_bd_pins s_sc_clk] [get_bd_pins s03_aw_node/s_sc_aclk] [get_bd_pins s03_w_node/s_sc_aclk] [get_bd_pins s03_b_node/m_sc_aclk]
connect_bd_net [get_bd_pins m_sc_clk] [get_bd_pins s03_aw_node/m_sc_aclk] [get_bd_pins s03_w_node/m_sc_aclk] [get_bd_pins s03_b_node/s_sc_aclk]
connect_bd_net [get_bd_pins s_sc_resetn] \
  [get_bd_pins s03_aw_node/s_sc_aresetn] [get_bd_pins s03_w_node/s_sc_aresetn] [get_bd_pins s03_b_node/m_sc_aresetn]
connect_bd_net [get_bd_pins m_sc_resetn] \
  [get_bd_pins s03_aw_node/m_sc_aresetn] [get_bd_pins s03_w_node/m_sc_aresetn] [get_bd_pins s03_b_node/s_sc_aresetn]

current_bd_instance /s04_entry_pipeline
connect_bd_intf_net [get_bd_intf_pins s04_mmu/M_AXI] [get_bd_intf_pins s04_transaction_regulator/S_AXI]
connect_bd_intf_net [get_bd_intf_pins s04_transaction_regulator/M_AXI] [get_bd_intf_pins s04_si_converter/S_AXI]
connect_bd_intf_net [get_bd_intf_pins s_axi] [get_bd_intf_pins s04_mmu/S_AXI]
connect_bd_intf_net [get_bd_intf_pins m_axi] [get_bd_intf_pins s04_si_converter/M_AXI]
connect_bd_net [get_bd_pins aclk] [get_bd_pins s04_mmu/aclk] [get_bd_pins s04_si_converter/aclk] [get_bd_pins s04_transaction_regulator/aclk]
connect_bd_net [get_bd_pins aresetn] \
  [get_bd_pins s04_mmu/aresetn] [get_bd_pins s04_si_converter/aresetn] [get_bd_pins s04_transaction_regulator/aresetn]

current_bd_instance /s04_nodes
connect_bd_intf_net [get_bd_intf_pins M_SC_AR] [get_bd_intf_pins s04_ar_node/M_SC]
connect_bd_intf_net [get_bd_intf_pins S_SC_AR] [get_bd_intf_pins s04_ar_node/S_SC]
connect_bd_intf_net [get_bd_intf_pins M_SC_R] [get_bd_intf_pins s04_r_node/M_SC]
connect_bd_intf_net [get_bd_intf_pins S_SC_R] [get_bd_intf_pins s04_r_node/S_SC]
connect_bd_intf_net [get_bd_intf_pins M_SC_AW] [get_bd_intf_pins s04_aw_node/M_SC]
connect_bd_intf_net [get_bd_intf_pins S_SC_AW] [get_bd_intf_pins s04_aw_node/S_SC]
connect_bd_intf_net [get_bd_intf_pins M_SC_W] [get_bd_intf_pins s04_w_node/M_SC]
connect_bd_intf_net [get_bd_intf_pins S_SC_W] [get_bd_intf_pins s04_w_node/S_SC]
connect_bd_intf_net [get_bd_intf_pins M_SC_B] [get_bd_intf_pins s04_b_node/M_SC]
connect_bd_intf_net [get_bd_intf_pins S_SC_B] [get_bd_intf_pins s04_b_node/S_SC]
connect_bd_net [get_bd_pins s_sc_clk] \
  [get_bd_pins s04_ar_node/s_sc_aclk] [get_bd_pins s04_aw_node/s_sc_aclk] [get_bd_pins s04_w_node/s_sc_aclk] \
  [get_bd_pins s04_r_node/m_sc_aclk] [get_bd_pins s04_b_node/m_sc_aclk]
connect_bd_net [get_bd_pins m_sc_clk] \
  [get_bd_pins s04_ar_node/m_sc_aclk] [get_bd_pins s04_aw_node/m_sc_aclk] [get_bd_pins s04_w_node/m_sc_aclk] \
  [get_bd_pins s04_r_node/s_sc_aclk] [get_bd_pins s04_b_node/s_sc_aclk]
connect_bd_net [get_bd_pins s_sc_resetn] \
  [get_bd_pins s04_ar_node/s_sc_aresetn] [get_bd_pins s04_aw_node/s_sc_aresetn] [get_bd_pins s04_w_node/s_sc_aresetn] \
  [get_bd_pins s04_r_node/m_sc_aresetn] [get_bd_pins s04_b_node/m_sc_aresetn]
connect_bd_net [get_bd_pins m_sc_resetn] \
  [get_bd_pins s04_ar_node/m_sc_aresetn] [get_bd_pins s04_aw_node/m_sc_aresetn] [get_bd_pins s04_w_node/m_sc_aresetn] \
  [get_bd_pins s04_r_node/s_sc_aresetn] [get_bd_pins s04_b_node/s_sc_aresetn]

current_bd_instance /s05_entry_pipeline
connect_bd_intf_net [get_bd_intf_pins s05_mmu/M_AXI] [get_bd_intf_pins s05_transaction_regulator/S_AXI]
connect_bd_intf_net [get_bd_intf_pins s05_transaction_regulator/M_AXI] [get_bd_intf_pins s05_si_converter/S_AXI]
connect_bd_intf_net [get_bd_intf_pins s_axi] [get_bd_intf_pins s05_mmu/S_AXI]
connect_bd_intf_net [get_bd_intf_pins m_axi] [get_bd_intf_pins s05_si_converter/M_AXI]
connect_bd_net [get_bd_pins aclk] [get_bd_pins s05_mmu/aclk] [get_bd_pins s05_si_converter/aclk] [get_bd_pins s05_transaction_regulator/aclk]
connect_bd_net [get_bd_pins aresetn] \
  [get_bd_pins s05_mmu/aresetn] [get_bd_pins s05_si_converter/aresetn] [get_bd_pins s05_transaction_regulator/aresetn]

current_bd_instance /s05_nodes
connect_bd_intf_net [get_bd_intf_pins M_SC_AR] [get_bd_intf_pins s05_ar_node/M_SC]
connect_bd_intf_net [get_bd_intf_pins S_SC_AR] [get_bd_intf_pins s05_ar_node/S_SC]
connect_bd_intf_net [get_bd_intf_pins M_SC_R] [get_bd_intf_pins s05_r_node/M_SC]
connect_bd_intf_net [get_bd_intf_pins S_SC_R] [get_bd_intf_pins s05_r_node/S_SC]
connect_bd_net [get_bd_pins s_sc_clk] [get_bd_pins s05_ar_node/s_sc_aclk] [get_bd_pins s05_r_node/m_sc_aclk]
connect_bd_net [get_bd_pins m_sc_clk] [get_bd_pins s05_ar_node/m_sc_aclk] [get_bd_pins s05_r_node/s_sc_aclk]
connect_bd_net [get_bd_pins s_sc_resetn] [get_bd_pins s05_ar_node/s_sc_aresetn] [get_bd_pins s05_r_node/m_sc_aresetn]
connect_bd_net [get_bd_pins m_sc_resetn] [get_bd_pins s05_ar_node/m_sc_aresetn] [get_bd_pins s05_r_node/s_sc_aresetn]

current_bd_instance /s06_entry_pipeline
connect_bd_intf_net [get_bd_intf_pins s06_mmu/M_AXI] [get_bd_intf_pins s06_transaction_regulator/S_AXI]
connect_bd_intf_net [get_bd_intf_pins s06_transaction_regulator/M_AXI] [get_bd_intf_pins s06_si_converter/S_AXI]
connect_bd_intf_net [get_bd_intf_pins s_axi] [get_bd_intf_pins s06_mmu/S_AXI]
connect_bd_intf_net [get_bd_intf_pins m_axi] [get_bd_intf_pins s06_si_converter/M_AXI]
connect_bd_net [get_bd_pins aclk] [get_bd_pins s06_mmu/aclk] [get_bd_pins s06_si_converter/aclk] [get_bd_pins s06_transaction_regulator/aclk]
connect_bd_net [get_bd_pins aresetn] \
  [get_bd_pins s06_mmu/aresetn] [get_bd_pins s06_si_converter/aresetn] [get_bd_pins s06_transaction_regulator/aresetn]

current_bd_instance /s06_nodes
connect_bd_intf_net [get_bd_intf_pins M_SC_AW] [get_bd_intf_pins s06_aw_node/M_SC]
connect_bd_intf_net [get_bd_intf_pins S_SC_AW] [get_bd_intf_pins s06_aw_node/S_SC]
connect_bd_intf_net [get_bd_intf_pins M_SC_W] [get_bd_intf_pins s06_w_node/M_SC]
connect_bd_intf_net [get_bd_intf_pins S_SC_W] [get_bd_intf_pins s06_w_node/S_SC]
connect_bd_intf_net [get_bd_intf_pins M_SC_B] [get_bd_intf_pins s06_b_node/M_SC]
connect_bd_intf_net [get_bd_intf_pins S_SC_B] [get_bd_intf_pins s06_b_node/S_SC]
connect_bd_net [get_bd_pins s_sc_clk] [get_bd_pins s06_aw_node/s_sc_aclk] [get_bd_pins s06_w_node/s_sc_aclk] [get_bd_pins s06_b_node/m_sc_aclk]
connect_bd_net [get_bd_pins m_sc_clk] [get_bd_pins s06_aw_node/m_sc_aclk] [get_bd_pins s06_w_node/m_sc_aclk] [get_bd_pins s06_b_node/s_sc_aclk]
connect_bd_net [get_bd_pins s_sc_resetn] \
  [get_bd_pins s06_aw_node/s_sc_aresetn] [get_bd_pins s06_w_node/s_sc_aresetn] [get_bd_pins s06_b_node/m_sc_aresetn]
connect_bd_net [get_bd_pins m_sc_resetn] \
  [get_bd_pins s06_aw_node/m_sc_aresetn] [get_bd_pins s06_w_node/m_sc_aresetn] [get_bd_pins s06_b_node/s_sc_aresetn]

current_bd_instance /s07_entry_pipeline
connect_bd_intf_net [get_bd_intf_pins s07_mmu/M_AXI] [get_bd_intf_pins s07_transaction_regulator/S_AXI]
connect_bd_intf_net [get_bd_intf_pins s07_transaction_regulator/M_AXI] [get_bd_intf_pins s07_si_converter/S_AXI]
connect_bd_intf_net [get_bd_intf_pins s_axi] [get_bd_intf_pins s07_mmu/S_AXI]
connect_bd_intf_net [get_bd_intf_pins m_axi] [get_bd_intf_pins s07_si_converter/M_AXI]
connect_bd_net [get_bd_pins aclk] [get_bd_pins s07_mmu/aclk] [get_bd_pins s07_si_converter/aclk] [get_bd_pins s07_transaction_regulator/aclk]
connect_bd_net [get_bd_pins aresetn] \
  [get_bd_pins s07_mmu/aresetn] [get_bd_pins s07_si_converter/aresetn] [get_bd_pins s07_transaction_regulator/aresetn]

current_bd_instance /s07_nodes
connect_bd_intf_net [get_bd_intf_pins M_SC_AW] [get_bd_intf_pins s07_aw_node/M_SC]
connect_bd_intf_net [get_bd_intf_pins S_SC_AW] [get_bd_intf_pins s07_aw_node/S_SC]
connect_bd_intf_net [get_bd_intf_pins M_SC_W] [get_bd_intf_pins s07_w_node/M_SC]
connect_bd_intf_net [get_bd_intf_pins S_SC_W] [get_bd_intf_pins s07_w_node/S_SC]
connect_bd_intf_net [get_bd_intf_pins M_SC_B] [get_bd_intf_pins s07_b_node/M_SC]
connect_bd_intf_net [get_bd_intf_pins S_SC_B] [get_bd_intf_pins s07_b_node/S_SC]
connect_bd_net [get_bd_pins s_sc_clk] [get_bd_pins s07_aw_node/s_sc_aclk] [get_bd_pins s07_w_node/s_sc_aclk] [get_bd_pins s07_b_node/m_sc_aclk]
connect_bd_net [get_bd_pins m_sc_clk] [get_bd_pins s07_aw_node/m_sc_aclk] [get_bd_pins s07_w_node/m_sc_aclk] [get_bd_pins s07_b_node/s_sc_aclk]
connect_bd_net [get_bd_pins s_sc_resetn] \
  [get_bd_pins s07_aw_node/s_sc_aresetn] [get_bd_pins s07_w_node/s_sc_aresetn] [get_bd_pins s07_b_node/m_sc_aresetn]
connect_bd_net [get_bd_pins m_sc_resetn] \
  [get_bd_pins s07_aw_node/m_sc_aresetn] [get_bd_pins s07_w_node/m_sc_aresetn] [get_bd_pins s07_b_node/s_sc_aresetn]
